# Altium schematic sheet Batterie.SchDoc
size A4; SheetNumber: 4; SheetTotal: 4
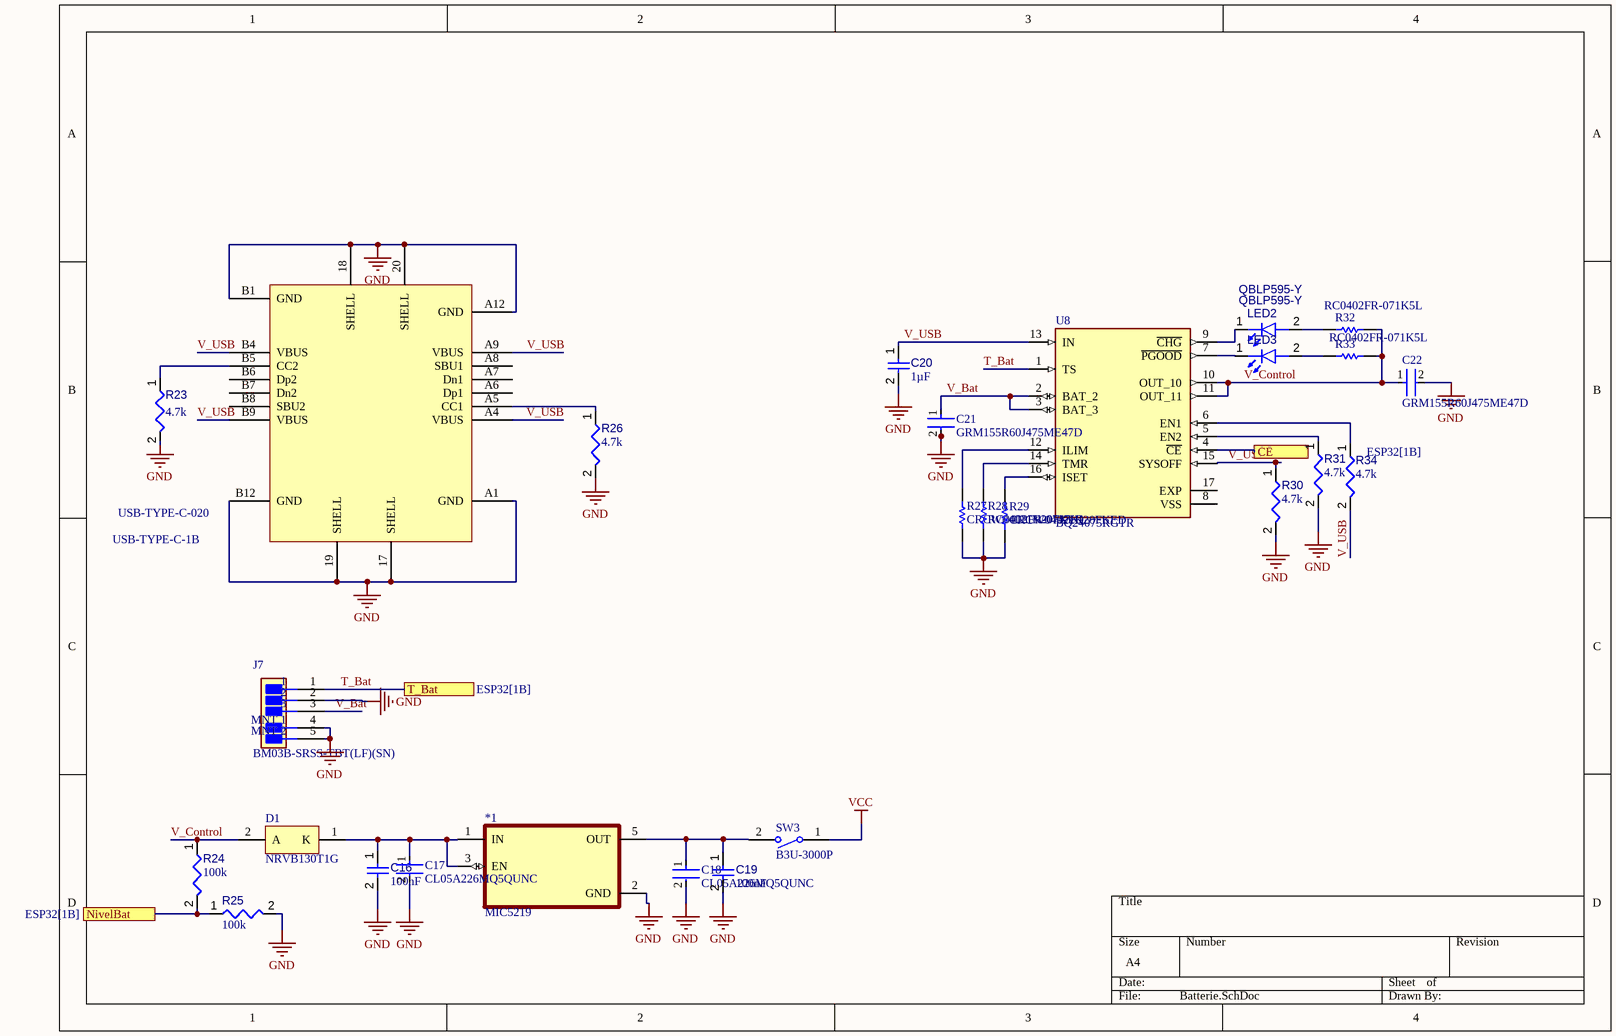
[diagram p0: Batterie.SchDoc]

## Parts
*1  MIC5219  [SOT95P280X145-5N]
C16  value 100nF  [CAPC1005X56X25LL10T15]  (hidden comment: Capacitor 0.1 uF +/- 5% 16 V 0402)
C17  CL05A226MQ5QUNC  [FP-CL746-IPC_C]
C18  CL05A226MQ5QUNC  [FP-CL746-IPC_C]
C19  value 100nF  [CAPC1005X56X25LL10T15]  (hidden comment: Capacitor 0.1 uF +/- 5% 16 V 0402)
C20  value 1µF  [CAPC1005X55X25LL05T10]  (hidden comment: Capacitor 1 uF +/- 10% 6.3 V 0402)
C21  GRM155R60J475ME47D  [FP-GRM155-0_1-IPC_B]
C22  GRM155R60J475ME47D  [FP-GRM155-0_1-IPC_B]
D1  NRVB130T1G  [ONSC-SOD-123-2-425-04_V]
J7  BM03B-SRSS-TBT(LF)(SN)  [FP-BM03B-SRSS-TBT_LF_SN-MFG]
LED2  QBLP595-Y  [QTB-QBLP595_V]
LED3  QBLP595-Y  [QTB-QBLP595_V]
R23  value 4.7k  [RESC1005X40X25ML05T05]  (hidden comment: Resistor 4k7 +/-1% 0402 100 mW)
R24  value 100k  [RESC1005X40X25ML05T05]  (hidden comment: Resistor 1k +/-1% 0402 63 mW)
R25  value 100k  [RESC1005X40X25ML05T05]  (hidden comment: Resistor 1k +/-1% 0402 63 mW)
R26  value 4.7k  [RESC1005X40X25ML05T05]  (hidden comment: Resistor 4k7 +/-1% 0402 100 mW)
R27  CRCW04021K20FKED  [RESC1005X40X25NL05T05]
R28  RC0402FR-0747KL  [RESC1005X40X25ML05T10]
R29  CRCW04021K20FKED  [RESC1005X40X25NL05T05]
R30  value 4.7k  [RESC1005X40X25ML05T05]  (hidden comment: Resistor 4k7 +/-1% 0402 100 mW)
R31  value 4.7k  [RESC1005X40X25ML05T05]  (hidden comment: Resistor 4k7 +/-1% 0402 100 mW)
R32  RC0402FR-071K5L  [RESC1005X40X25ML05T10]
R33  RC0402FR-071K5L  [RESC1005X40X25ML05T10]
R34  value 4.7k  [RESC1005X40X25ML05T05]  (hidden comment: Resistor 4k7 +/-1% 0402 100 mW)
SW3  B3U-3000P  [OMRON-B3U-3000P_V]
U8  BQ24075RGTR  [QFN50P300X300X100-17N]
USB-TYPE-C-1  USB-TYPE-C-020  [PCBComponent_1]  (part B of 2)

## Ports
CE (see ESP32[1B]), NivelBat (see ESP32[1B]), T_Bat (see ESP32[1B])

## Nets
GND: *1.2(GND) C16.2 C17.2 C18.2 C19.2 C20.2 C21.2 C22.2 J7.2 J7.4(MNT_1) J7.5(MNT_2) R23.2 R25.2 R26.2 R27.1 R28.2 R29.1 R30.2 R31.2 USB-TYPE-C-1.17(SHELL) USB-TYPE-C-1.18(SHELL) USB-TYPE-C-1.19(SHELL) USB-TYPE-C-1.20(SHELL) USB-TYPE-C-1.A1(GND) USB-TYPE-C-1.A12(GND) USB-TYPE-C-1.B1(GND) USB-TYPE-C-1.B12(GND)
VCC: SW3.1
CE: U8.4(~{CE}) ; port CE
NivelBat: R24.2 R25.1 ; port NivelBat
T_Bat: J7.1 U8.1(TS) ; port T_Bat
V_Bat: C21.1 J7.3 U8.2(BAT_2) U8.3(BAT_3)
V_Control: C22.1 D1.2(A) R24.1 R32.2 R33.2 U8.10(OUT_10) U8.11(OUT_11)
V_USB: C20.1 R30.1 R34.2 U8.13(IN) U8.15(SYSOFF) USB-TYPE-C-1.A4(VBUS) USB-TYPE-C-1.A9(VBUS) USB-TYPE-C-1.B4(VBUS) USB-TYPE-C-1.B9(VBUS)
Net*1_1: *1.1(IN) *1.3(EN) C16.1 C17.1 D1.1(K)
Net*1_5: *1.5(OUT) C18.1 C19.1 SW3.2
NetLED2_1: LED2.1(K) U8.9(~{CHG})
NetLED2_2: LED2.2(A) R32.1
NetLED3_1: LED3.1(K) U8.7(~{PGOOD})
NetLED3_2: LED3.2(A) R33.1
NetR23_1: R23.1 USB-TYPE-C-1.B5(CC2)
NetR26_1: R26.1 USB-TYPE-C-1.A5(CC1)
NetR27_2: R27.2 U8.12(ILIM)
NetR28_1: R28.1 U8.14(TMR)
NetR29_2: R29.2 U8.16(ISET)
NetR31_1: R31.1 U8.5(EN2)
NetR34_1: R34.1 U8.6(EN1)

Not connected (* = marked no-connect by the designer): U8 8(VSS) 17(EXP); USB-TYPE-C-1 A6(Dp1) A7(Dn1) A8(SBU1) B6(Dp2) B7(Dn2) B8(SBU2)

## Library data of the parts
*1 = CMP-018-000000-2: Fixed Positive LDO Regulator, 3.3V, 0.6V Dropout, BIPolar, PDSO5; Output Current1-Max: 500mA; Package Equivalence Code: TSOP5/6,.11,37; Regulator Type: FIXED POSITIVE SINGLE OUTPUT LDO REGULATOR; Output Voltage1-Max: 3.366V; Output Voltage1-Min: 3.234V; Package Body Material: Plastic; Input Voltage Absolute-Max: 20V; Dropout Voltage1-Max: 600mV; Time @ Peak Reflow Temperature-Max (s): 30s; Channels: 1; Line Regulation-Max: 0.02541%; Qualification Status: Not Qualified; Max Supply Voltage: 12V; Voltage Tolerance-Max: 2%; Min Input Voltage: 2.5V; Load Regulation-Max: 0.0231%; Technology: BIPOLAR; Operating Temperature, TJ-Max: 125°C; Moisture Sensitivity Level: 1; Package Shape: Rectangular; JESD-30 Code: R-PDSO-G5; Package Style: SMALL OUTLINE, LOW PROFILE, SHRINK PITCHMeter; Surface Mount: Yes; Operating Temperature, TJ-Min: -40°C; Width: 1.6mm; Source: MIC5219-3.3YM5.SchLib; Output Voltage1-Nom: 3.3V; RoHS Compliant: No; JESD-609 Code: e0; Terminal Finish: Tin; Component Type: Standard; Terminal Position: DUAL; Height - Seated (Max): 1.45mm; Length: 2.9mm; Case/Package: LSSOP; Pin Count: 4; Pins: 5; Terminal Form: Gull Wing; Design Item ID: Component_1; Reach SVHC Compliant: No; Adjustability: FIXED; Number of Outputs: 1; Peak Reflow Temperature (Cel): 240°C; Terminal Pitch: 0.95mm
C16 C19 = CMP-001-00001-6: Chip Capacitor, 0.1 uF, +/- 5%, 16 V, 0402 (1005 Metric); Capacitor Type: Ceramic; Voltage Rating: 16V; Max Operating Temperature: 125°C; Min Operating Temperature: -55°C; Case/Package: 0402; Mounting Technology: SM; Pins: 2; Tolerance: 5%; RoHS Compliant: True
C17 C18 = CMP-13271-000286-1: Cap Ceramic 22uF 6.3V X5R ±20% SMD 0402 +85°C Paper T/R; Case Code (Imperial): 0402; Tolerance: 20%; Width: 0.02inch; Packaging: Tape and Reel; Case/Package: 0402; Min Operating Temperature: -55°C; Max Operating Temperature: 85°C; Voltage Rating: 6.3V; Capacitance: 22uF; Thickness: 0.022inch; Mount: Surface Mount; Length: 0.039inch; Case Code (Metric): 1005
C20 = CMP-001-00008-6: Chip Capacitor, 1 uF, +/- 10%, 6.3 V, 0402 (1005 Metric); Capacitor Type: Ceramic; Voltage Rating: 6.3V; Max Operating Temperature: 85°C; Mounting Technology: SM; Tolerance: 10%; Case/Package: 0402; RoHS Compliant: True; Min Operating Temperature: -55°C; Pins: 2
C21 C22 = CMP-2008-04549-2: Chip Multilayer Ceramic Capacitors for General Purpose, 0402, 4.7uF, X5R, 15%, 20%, 6.3V; Height: 0.5mm; Weight: 0.000212oz; Length: 1mm; Case Code (Metric): 1005; Packaging: Tape and Reel; Termination: SMD/SMT; Dielectric: X5R; Depth: 0.5mm; Case Code (Imperial): 0402; Min Operating Temperature: -55°C; Case/Package: 0402; Voltage: 6.3V; Width: 0.02inch; Capacitance: 4.7uF; Lead Free: Lead Free; Thickness: 0.022inch; Contact Plating: Tin; REACH SVHC: No SVHC; Package Quantity: 10000; Tolerance: 20%; Voltage Rating (DC): 6.3V; Voltage Rating: 6.3V; Mount: Surface Mount; Max Operating Temperature: 85°C
D1 = CMP-1055-00419-1: Schottky Power Rectifier, 2-Pin SOD-123, Pb-Free, Tape and Reel; Manufacturer: On Semiconductor; Configuration: Single; IFSM Max (A): 5.5; DatasheetVersion: Rev. 4; PackageDescription: 2-Pin SOD, Body 1.6 x 2.69 mm; PackageReference: SOD-123-2-425-04; ComponentLink1URL: http://www.onsemi.com/; Packing: Tape and Reel; ComponentLink3Description: Package Specification; ComponentLink2URL: http://www.onsemi.cn/pub_link/Collateral/MBR130T1-D.PDF; PackageVersion: Rev. G, 10/2009; PartNumber: NRVB130T1G; ComponentLink3URL: http://www.onsemi.com/pub_link/Collateral/425-04.PDF; ComponentLink1Description: Manufacturer URL; RoHS: TRUE; Mounting Technology: Surface Mount; ComponentLink2Description: Datasheet
J7 = CMP-00030-00002-2: Conn Shrouded Header (4 Sides) HDR 3 POS 1mm Solder ST Top Entry SMD T/R
LED2 LED3 = CMP-007-00043-3: Chip LED 0402, Yellow, 0.02 A, 3.1 to 3.7 V, -40 to 80 degC, 2-Pin SMD, RoHS, Tape and Reel; Mounting Technology: SMT; Case/Package: 0402; RoHS Compliant: Yes; Pins: 2; Colour: Yellow
R23 R26 R30 R31 R34 = CMP-009-00030-5: Chip Resistor, 4.7 KOhm, +/- 1%, 0.1 W, -55 to 155 degC, 0402 (1005 Metric); Power: 100mW; Voltage Rating: 50V; Mounting Technology: SM; RoHS Compliant: True; Tolerance: 1%; Min Operating Temperature: -55°C; Max Operating Temperature: 155°C; Case/Package: 0402; Pins: 2
R24 R25 = CMP-009-00012-5: Chip Resistor, 1 KOhm, +/- 1%, 63 mW, -55 to 155 degC, 0402 (1005 Metric); Power: 63mW; Max Operating Temperature: 155°C; Min Operating Temperature: -55°C; Case/Package: 0402; Pins: 2; RoHS Compliant: True; Tolerance: 1%; Mounting Technology: SM
R27 R29 = CMP-2002-08284-1: Manufacturer: Vishay Dale; Part Number: CRCW04021K20FKED
R28 = CMP-2002-07701-1: Manufacturer: Yageo / Phycomp; Part Number: RC0402FR-0747KL
R32 R33 = CMP-2002-07464-1: Manufacturer: Yageo / Phycomp; Part Number: RC0402FR-071K5L
SW3 = CMP-011-00005-2: Tactile Switch, SPST-NO, 0.05 A, 12 V, -25 to 70 degC, 2-Pin SMD, RoHS, Tape and Reel; Manufacturer: Omron Electronic Components; Operating Force: 162gf; Voltage Rating (DC): 12V; Current Rating: 50mA; IP Rating: IP40; Throw Configuration: SPST; Max Contact Resistance: 100mohm; RoHS Compliant: True; Contact Current Rating: 50mA; Manufacturer URL: http://www.omron.com/; Packaging: TapeandReel; Max Voltage Rating (DC): 12V; Contact Material: Silver; Datasheet Version: Jan-15; Package Reference: B3U-3000P; Package Description: 2-Pin Surface Mount Device, Body 4 x 3.2 mm; Min Operating Temperature: -25°C; Package Quantity: 4000; Max Operating Temperature: 70°C; Max Current Rating: 50mA; Voltage Rating: 12V; Case/Package: B3U-3000P; Mounting Technology: SM; Datasheet URL: https://www.omron.com/ecb/products/pdf/en-b3u.pdf
U8 = CMP-009-000000-1: Standalone 1-cell 1.5-A linear charger, Power Path, 4.2-V VBAT and 5.5-V VOUT 16-VQFN -40 to 85; Component Type: Standard; Package: None; Value: *; MP: BQ24075RGTR; Availability: Unavailable; Price: None; Pin Count: 17; Design Item ID: BQ24075RGTR; Source: BQ24075RGTR.SchLib
USB-TYPE-C-1 = CMP-029-000000-1: Pin Count: 20; Design Item ID: USB-TYPE-C-020; Component Type: Standard; Source: USBConnector.SchLib